# Altium schematic sheet PORTS.SchDoc
size A
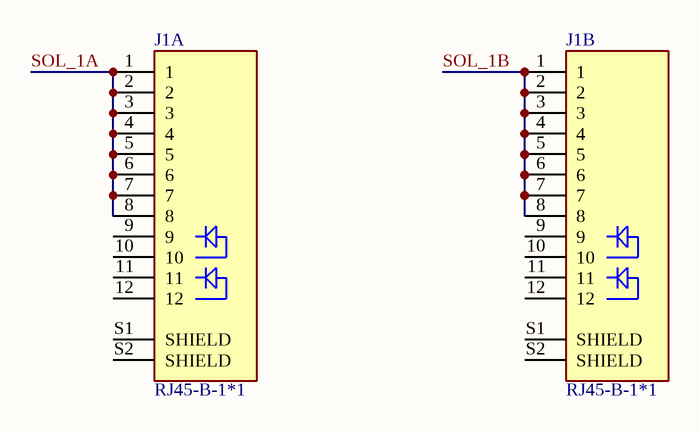
[diagram p0: PORTS.SchDoc]

## Parts
J1A  RJ45-B-1*1  [TE_2-406549-1]
J1B  RJ45-B-1*1  [TE_2-406549-1]

## Nets
SOL_1A: J1A.1 J1A.2 J1A.3 J1A.4 J1A.5 J1A.6 J1A.7 J1A.8
SOL_1B: J1B.1 J1B.2 J1B.3 J1B.4 J1B.5 J1B.6 J1B.7 J1B.8

Not connected (* = marked no-connect by the designer): J1A 9 10 11 12 S1(SHIELD) S2(SHIELD); J1B 9 10 11 12 S1(SHIELD) S2(SHIELD)

## Library data of the parts
J1A J1B = RJ45-B-1*1: J - JACK - ETHERNET - Right - THT; LCSC Part #: C138392; JLC Availability: Extended